# EasyEDA Pro project ProPrj_buatPCB_2026-03-01.epro

# Schematic Schematic1
Board Name: Board1; Create Date: 2026-03-01; Page Name: P1; Project Name: buatPCB; Schematic Name: Schematic1; Update Date: 2026-03-01; Company: EasyEDA.com; Page Size: A4; Version: V1.0
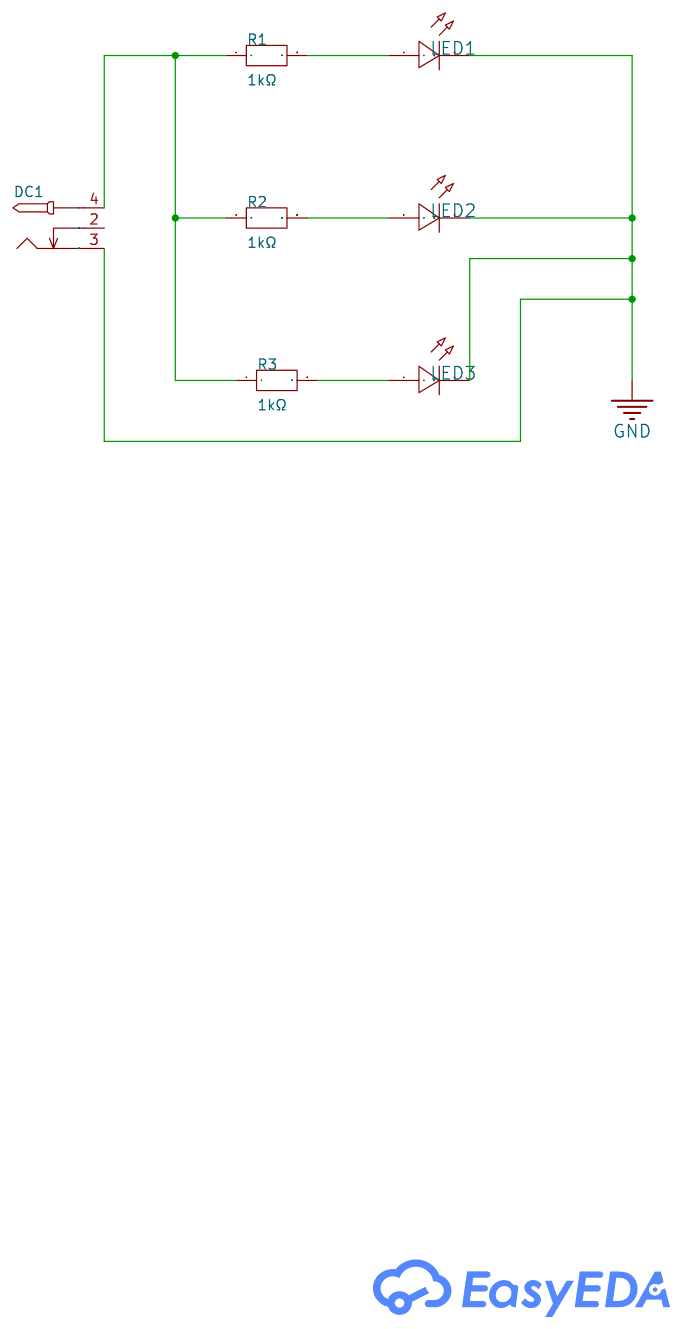
[diagram p0: schematic sheet]

## Parts
DC1  -  [DC-IN-TH_DC-5520-1]
LED1  -  [LED0402-RD_YELLOW]
LED2  -  [LED0402-RD_YELLOW]
LED3  -  [LED0402-RD_YELLOW]
R1  1kΩ  [R0402]
R2  1kΩ  [R0402]
R3  1kΩ  [R0402]

## Library data of the parts
DC1 = DC-005_2.0: Supplier Footprint: Through
LED1-LED3 = LED_0402-R: Supplier Footprint: 0402
R1-R3 = ERJ-PA2D1001X: Type:Thick Film Resistor Resistance:1kΩ Tolerance:±0.5% Tolerance:±0.5% Power(Watts):250mW Temperature Coefficient:±100ppm/℃ Temperature Coefficient:±100ppm/℃ Operating Temperature:-55℃~+155℃ Operating Temperature:-55℃~+155℃; LCSC Part Name: 1kΩ ±0.5% 250mW 厚膜电阻; Supplier Part: C6945516; Manufacturer: PANASONIC(松下); Supplier Footprint: 0402; Datasheet: https://item.szlcsc.com/datasheet/ERJ-PA2D1001X/7911295.html; Supplier: LCSC; Type: Thick Film Resistor; Tolerance: ±0.5%; Power(Watts): 250mW; Temperature Coefficient: ±100ppm/℃; Operating Temperature: -55℃~+155℃

## Nets
GND: DC1.3 LED1.2(C) LED2.2(C) LED3.2(C)
$1N481: DC1.4 R1.1 R2.1 R3.1
$1N486: LED1.1(A) R1.2
$1N517: LED2.1(A) R2.2
$1N522: LED3.1(A) R3.2

Not connected (* = marked no-connect by the designer): DC1 2

# Board PCB1
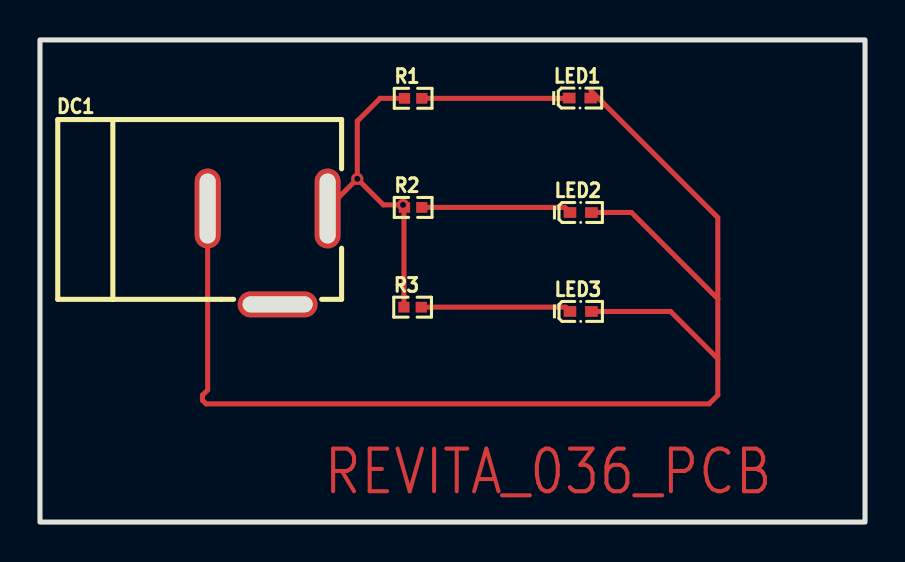
[diagram p1: board, top side]
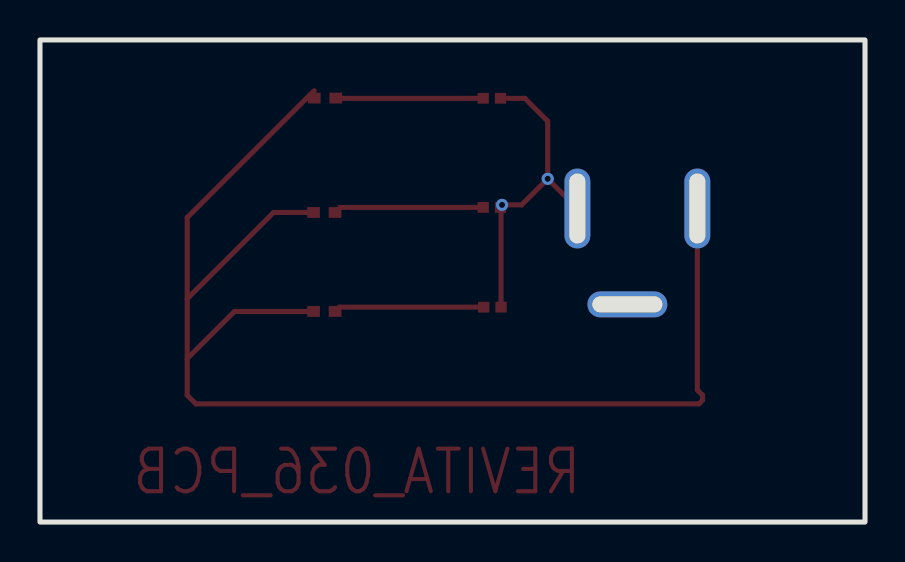
[diagram p2: board, bottom side, seen from below]

Outline 41.28 x 24.13 mm; copper layers: Top Layer, Bottom Layer. Coordinates in mm from the lower left corner of the outline.
Outline path: rectangle 0,24.13 41.28,0
Stack: Top Layer 0.035mm / Dielectric1 1.51mm FR4 er 4.5 / Bottom Layer 0.035mm

## Design rules (mm)
template: JLCPCB Capability(Two Layers Board)
spacing copperThickness1oz (default): track to track 0.102, other pairs 0.152 to 0.3
spacing copperThickness2oz: track to track 0.203, other pairs 0.152 to 0.3
track width copperThickness1oz (default): min 0.127, default 0.254, max 2.54
track width copperThickness2oz: min 0.203, default 0.254, max 2.54
differential pair differentialPair (default): width min 0.127, default 0.254, max 2.54; gap min 0.152, default 0.152
via viaSize (default): diameter min 0.5, default 0.61, max 10; hole min 0.3, default 0.305, max 6.3

## Placement (name value [footprint] x y rotation side)
DC1  -  [DC-IN-TH_DC-5520-1]  11.39 13.29 0 top
LED1  -  [LED0402-RD_YELLOW]  27.02 21.22 0 top
LED2  -  [LED0402-RD_YELLOW]  27.05 15.49 0 top
LED3  -  [LED0402-RD_YELLOW]  27.05 10.54 0 top
R1  1kΩ  [R0402]  18.67 21.21 0 top
R2  1kΩ  [R0402]  18.67 15.75 0 top
R3  1kΩ  [R0402]  18.64 10.76 0 top

## Footprints (pads in the part's own frame, mm; a bottom-side part is the same pattern mirrored in y, then rotated)
DC-IN-TH_DC-5520-1
  oval 4x1.3 hole 3.5x0.8: 2(0.5,-2.4)
  oval 1.3x4 hole 0.8x3.5: 3(-3,2.4) 4(3,2.4)
LED0402-RD_YELLOW
  rect 0.636x0.54 smd: 1(-0.538,0) 2(0.538,0)
R0402
  rect 0.566x0.54 smd: 1(-0.433,0) 2(0.433,0)

## Nets
As in the schematic.

Pads without a net: DC1 2

## Via types
v1: diameter 0.61, hole 0.305, Top Layer to Bottom Layer, 2 vias

## Routing (per net, layer and track width the routed paths; a pad name or vN(x,y) marks a point on that pad's centre or on a via; arc(x,y) is an arc through that point)
GND: length 69
  Top Layer w0.254: 33.91,8.18 33.91,6.35 33.48,5.92 8.31,5.92 8.13,6.1 8.13,6.35 8.39,6.61 DC1.3 ; 33.91,8.18 31.55,10.54 LED3.2 ; 33.91,8.18 33.91,11.18 ; LED2.2 29.59,15.49 33.91,11.18 ; 33.91,11.18 33.91,15.24 27.56,21.59
$1N481: length 15.8
  Top Layer w0.254: DC1.4 v1(15.88,17.18) ; v1(15.88,17.18) 15.88,20.07 17.02,21.21 R1.1 ; v1(15.88,17.18) 17.18,15.88 v1(18.16,15.88) 18.21,15.83 R3.1
$1N486: length 7.4
  Top Layer w0.254: LED1.1 26.46,21.21 R1.2
$1N517: length 7.5
  Top Layer w0.254: R2.2 26.26,15.75 26.51,15.49
$1N522: length 7.5
  Top Layer w0.254: 26.51,10.54 26.3,10.76 R3.2

## Text on the board
Top Layer: REVITA_036_PCB
